# EAGLE schematic B (EAGLE 7.5.0)
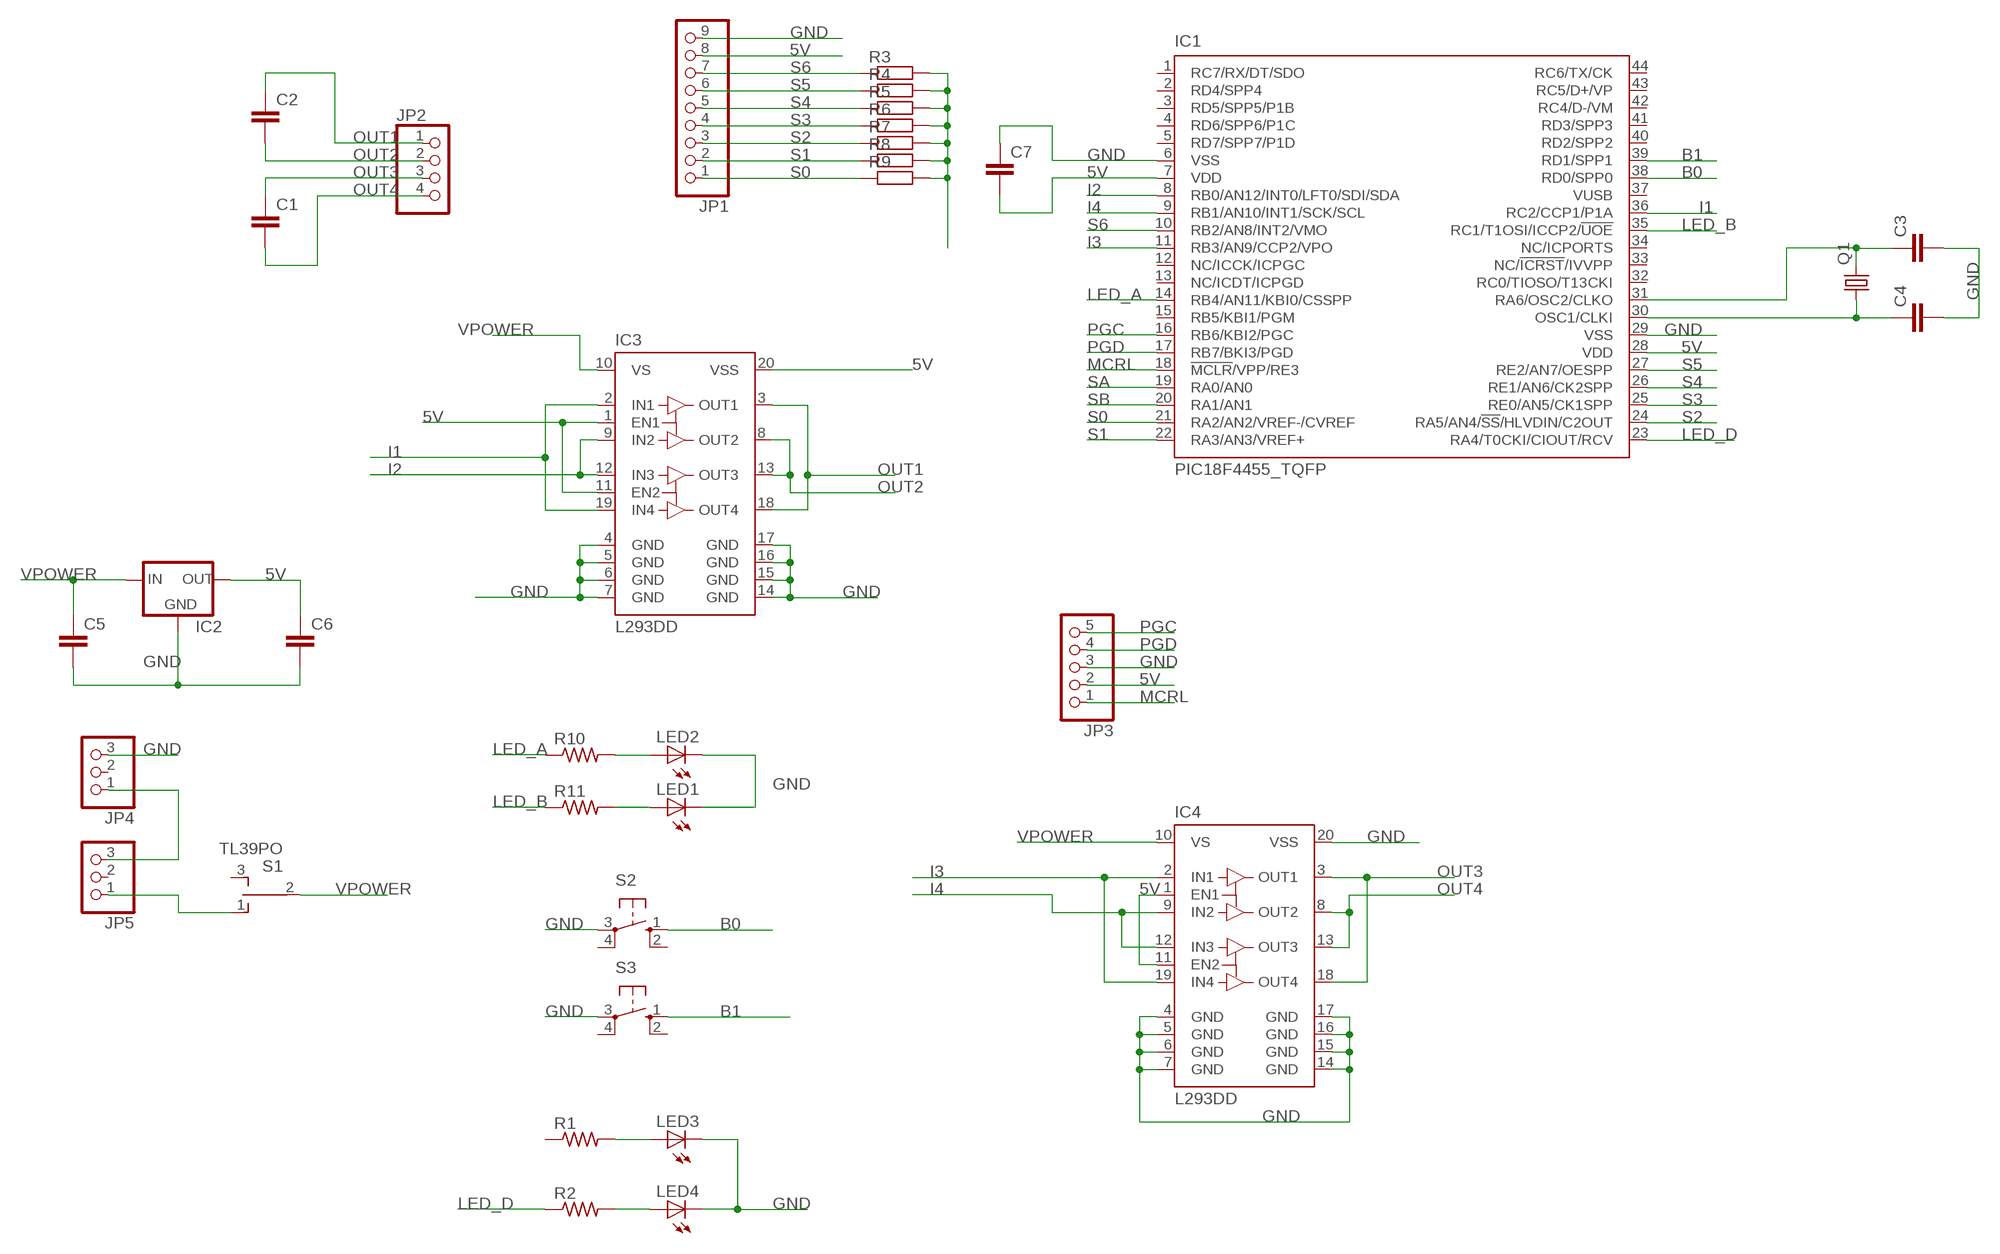
[diagram p0: schematic, sheet 1]

## Parts
C1  C2,5-3  [C2.5-3]
C2  C2,5-3  [C2.5-3]
C3  C2,5-3  [C2.5-3]
C4  C2,5-3  [C2.5-3]
C5  C2,5-3  [C2.5-3]
C6  C2,5-3  [C2.5-3]
C7  C2,5-3  [C2.5-3]
IC1  PIC18F4455_TQFP  [TQFP44]
IC2  78XXS  [78XXS]
IC3  L293DD  [SO20]
IC4  L293DD  [SO20]
JP1  PINHD-1X9  [1X09]
JP2  PINHD-1X4  [1X04]
JP3  PINHD-1X5  [1X05]
JP4  PINHD-1X3  [1X03]
JP5  PINHD-1X3  [1X03]
LED1  LEDCHIPLED_1206  [CHIPLED_1206]
LED2  LEDCHIPLED_1206  [CHIPLED_1206]
LED3  LEDCHIPLED_1206  [CHIPLED_1206]
LED4  LEDCHIPLED_1206  [CHIPLED_1206]
Q1  CRYSTALHC49S  [HC49/S]
R1  R-US_R0805  [R0805]
R2  R-US_R0805  [R0805]
R3  R-EU_M0805  [M0805]
R4  R-EU_M0805  [M0805]
R5  R-EU_M0805  [M0805]
R6  R-EU_M0805  [M0805]
R7  R-EU_M0805  [M0805]
R8  R-EU_M0805  [M0805]
R9  R-EU_M0805  [M0805]
R10  R-US_M0805  [M0805]
R11  R-US_M0805  [M0805]
S1  TL39PO  [TL3XPO]
S2  10-XX  [B3F-10XX]
S3  10-XX  [B3F-10XX]

## Nets
5V: C6.1 C7.2 IC1.7(VDD) IC1.28(VDD) IC2.OUT IC3.1(EN1) IC3.11(EN2) IC3.20(VSS) IC4.1(EN1) IC4.11(EN2) JP1.8 JP3.2 R3.2 R4.2 R5.2 R6.2 R7.2 R8.2 R9.2
B0: IC1.38(RD0/SPP0) S2.1(S)
B1: IC1.39(RD1/SPP1) S3.1(S)
GND: C3.2 C4.2 C5.2 C6.2 C7.1 IC1.6(VSS) IC1.29(VSS) IC2.GND IC3.4(GND) IC3.5(GND) IC3.6(GND) IC3.7(GND) IC3.14(GND) IC3.15(GND) IC3.16(GND) IC3.17(GND) IC4.4(GND) IC4.5(GND) IC4.6(GND) IC4.7(GND) IC4.14(GND) IC4.15(GND) IC4.16(GND) IC4.17(GND) IC4.20(VSS) JP1.9 JP3.3 JP4.3 LED1.C LED2.C LED3.C LED4.C S2.3(P) S3.3(P)
I1: IC1.36(RC2/CCP1/P1A) IC3.2(IN1) IC3.19(IN4)
I2: IC1.8(RB0/AN12/INT0/LFT0/SDI/SDA) IC3.9(IN2) IC3.12(IN3)
I3: IC1.11(RB3/AN9/CCP2/VPO) IC4.2(IN1) IC4.19(IN4)
I4: IC1.9(RB1/AN10/INT1/SCK/SCL) IC4.9(IN2) IC4.12(IN3)
LED_A: IC1.14(RB4/AN11/KBI0/CSSPP) R10.1
LED_B: IC1.35(RC1/T1OSI/ICCP2/!UOE) R11.1
LED_D: IC1.23(RA4/T0CKI/CIOUT/RCV) R2.1
MCRL: IC1.18(!MCLR!/VPP/RE3) JP3.1
N$17: C4.1 IC1.30(OSC1/CLKI) Q1.1
N$18: C3.1 IC1.31(RA6/OSC2/CLKO) Q1.2
N$19: JP4.1 JP5.3
N$20: LED2.A R10.2
N$21: LED1.A R11.2
N$24: LED3.A R1.2
N$25: LED4.A R2.2
OUT1: C2.1 IC3.3(OUT1) IC3.18(OUT4) JP2.1
OUT2: C2.2 IC3.8(OUT2) IC3.13(OUT3) JP2.2
OUT3: C1.1 IC4.3(OUT1) IC4.18(OUT4) JP2.3
OUT4: C1.2 IC4.8(OUT2) IC4.13(OUT3) JP2.4
PGC: IC1.16(RB6/KBI2/PGC) JP3.5
PGD: IC1.17(RB7/BKI3/PGD) JP3.4
S0: IC1.21(RA2/AN2/VREF-/CVREF) JP1.1 R9.1
S1: IC1.22(RA3/AN3/VREF+) JP1.2 R8.1
S2: IC1.24(RA5/AN4/!SS!/HLVDIN/C2OUT) JP1.3 R7.1
S3: IC1.25(RE0/AN5/CK1SPP) JP1.4 R6.1
S4: IC1.26(RE1/AN6/CK2SPP) JP1.5 R5.1
S5: IC1.27(RE2/AN7/OESPP) JP1.6 R4.1
S6: IC1.10(RB2/AN8/INT2/VMO) JP1.7 R3.1
SA: IC1.19(RA0/AN0)
SB: IC1.20(RA1/AN1)
VPOWER: C5.1 IC2.IN IC3.10(VS) IC4.10(VS) S1.2(P)
VPREV: JP5.1 S1.1(O)
Unconnected: IC1.1(RC7/RX/DT/SDO) IC1.2(RD4/SPP4) IC1.3(RD5/SPP5/P1B) IC1.4(RD6/SPP6/P1C) IC1.5(RD7/SPP7/P1D) IC1.12(NC/ICCK/ICPGC) IC1.13(NC/ICDT/ICPGD) IC1.15(RB5/KBI1/PGM) IC1.32(RC0/TIOSO/T13CKI) IC1.33(NC/!ICRST!/IVVPP) IC1.34(NC/ICPORTS) IC1.37(VUSB) IC1.40(RD2/SPP2) IC1.41(RD3/SPP3) IC1.42(RC4/D-/VM) IC1.43(RC5/D+/VP) IC1.44(RC6/TX/CK) JP4.2 JP5.2 R1.1 S1.3(S) S2.2(S1) S2.4(P1) S3.2(S1) S3.4(P1)

## Library data of the parts
C1-C7 = capacitor-wima:C: CAPACITOR naming: grid - package width
IC1 = microchip:PIC18F4*_TQFP: USB Microcontrollers with nanoWatt Technology High-Performance, Enhanced Flash, 28/40/44-Pin, Source: http://ww1.microchip.com/downloads/en/devicedoc/39632c.pdf; MF: MICROCHIP; MPN: PIC18F4455-I/PT; OC_FARNELL: 9321322; OC_NEWARK: 08J9628
IC2 = v-reg:78XXS: VOLTAGE REGULATOR
IC3 IC4 = st-microelectronics:L293DD: PUSH-PULL FOUR CHANNEL DRIVER WITH DIODES Source: http://www.st.com/stonline/books/pdf/docs/1330.pdf; OC_FARNELL: unknown
JP1 = pinhead:PINHD-1X9: PIN HEADER
JP2 = pinhead:PINHD-1X4: PIN HEADER
JP3 = pinhead:PINHD-1X5: PIN HEADER
JP4 JP5 = pinhead:PINHD-1X3: PIN HEADER
LED1-LED4 = adafruit:LED: LED OSRAM: - CHIPLED LG R971, LG N971, LY N971, LG Q971, LY Q971, LO R971, LY R971 LH N974, LH R974 LS Q976, LO Q976, LY Q976 LO Q996 - Hyper CHIPLED LW Q18S LB Q993, LB Q99A, LB R99A - SideLED LS A670, LO A670, LY A670, LG A670, LP A670 LB A673, LV A673, LT A673, LW A673 LH A674 LY A675 LS A676, LA A676, LO A676, LY A676, LW A676 LS A679, LY A679, LG A679 - Hyper Micro SIDELED® LS Y876, LA Y876, LO Y876, LY Y876 LT Y87S - SmartLED LW L88C, LW L88S LB L89C, LB L89S, LG L890 LS L89K, LO L89K, LY L89K LS L896, LA L896, LO L896, LY L896 - TOPLED LS T670, LO T670, LY T670, LG T670, LP T670 LSG T670, LSP T670, LSY T670, LOP T670, LYG T670 LG T671, LOG T671, LSG T671 LB T673, LV T673, LT T673, LW T673 LH T674 LS T676, LA T676, LO T676, LY T676, LB T676, LH T676, LSB T676, LW T676 LB T67C, LV T67C, LT T67C, LS T67K, LO T67K, LY T67K, LW E67C LS E67B, LA E67B, LO E67B, LY E67B, LB E67C, LV E67C, LT E67C LW T67C LS T679, LY T679, LG T679 LS T770, LO T770, LY T770, LG T770, LP T770 LB T773, LV T773, LT T773, LW T773 LH T774 LS E675, LA E675, LY E675, LS T675 LS T776, LA T776, LO T776, LY T776, LB T776 LHGB T686 LT T68C, LB T68C - Hyper Mini TOPLED® LB M676 - Mini TOPLED Santana® LG M470 LS M47K, LO M47K, LY M47K Source: http://www.osram.convergy.de/
Q1 = crystal:CRYSTAL: CRYSTAL; OC_FARNELL: 1667008; OC_NEWARK: unknown
R1 R2 = resistor:R-US_: RESISTOR, American symbol
R3-R9 = resistor:R-EU_: RESISTOR, European symbol
R10 R11 = adafruit:R-US_: RESISTOR, American symbol
S1 = switch:TL39PO: TINY SWITCH ON OFF ON Source: http://www2.produktinfo.conrad.com/datenblaetter/700000-724999/705152-da-01-de-Subminiaturschalter_TL_36YO.pdf
S2 S3 = switch-omron:10-XX: OMRON SWITCH; MPN: B3F-1000; OC_FARNELL: 176432; OC_NEWARK: 36M3542